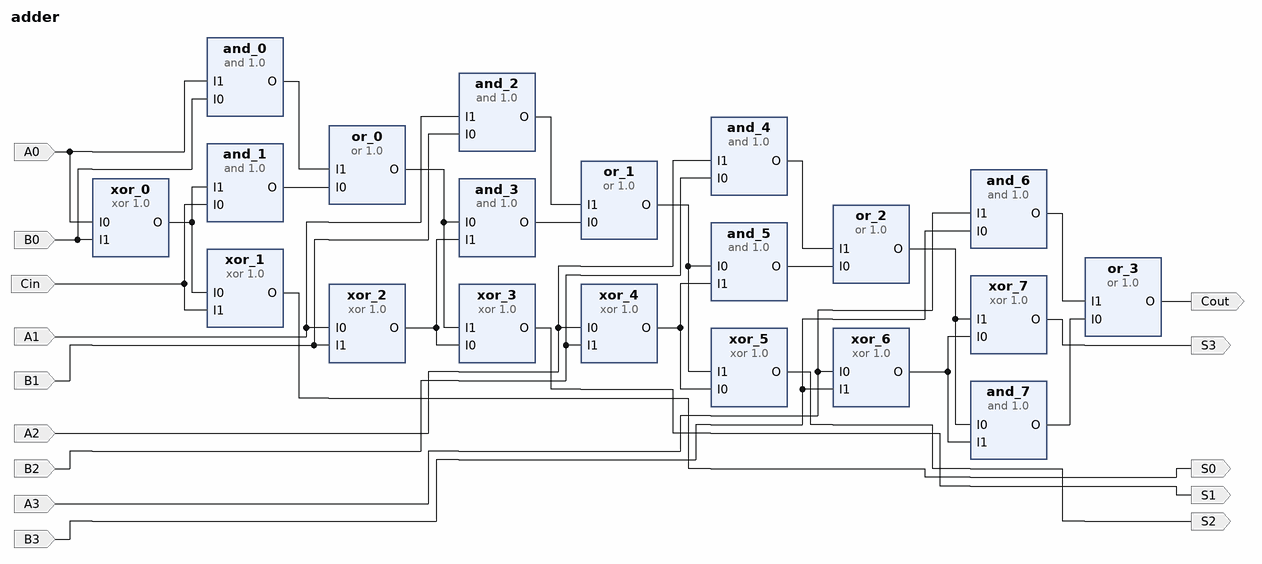
[diagram p0: block diagram of the top level]
# Vivado block design adder, xc7a35tcpg236-1, Vivado 2018.2
create_bd_design adder

create_bd_port -dir I A0
create_bd_port -dir I B0
create_bd_port -dir I Cin
create_bd_port -dir O S0
create_bd_port -dir I A1
create_bd_port -dir I B1
create_bd_port -dir O S1
create_bd_port -dir I A2
create_bd_port -dir I B2
create_bd_port -dir O S2
create_bd_port -dir I A3
create_bd_port -dir I B3
create_bd_port -dir O S3
create_bd_port -dir O Cout

create_bd_cell -type ip -vlnv FIT:user:and:1.0 and_0
create_bd_cell -type ip -vlnv FIT:user:and:1.0 and_1
create_bd_cell -type ip -vlnv FIT:user:or:1.0 or_0
create_bd_cell -type ip -vlnv FIT:user:xor:1.0 xor_0
create_bd_cell -type ip -vlnv FIT:user:xor:1.0 xor_1
create_bd_cell -type ip -vlnv FIT:user:and:1.0 and_2
create_bd_cell -type ip -vlnv FIT:user:and:1.0 and_3
create_bd_cell -type ip -vlnv FIT:user:or:1.0 or_1
create_bd_cell -type ip -vlnv FIT:user:xor:1.0 xor_2
create_bd_cell -type ip -vlnv FIT:user:xor:1.0 xor_3
create_bd_cell -type ip -vlnv FIT:user:and:1.0 and_4
create_bd_cell -type ip -vlnv FIT:user:and:1.0 and_5
create_bd_cell -type ip -vlnv FIT:user:or:1.0 or_2
create_bd_cell -type ip -vlnv FIT:user:xor:1.0 xor_4
create_bd_cell -type ip -vlnv FIT:user:xor:1.0 xor_5
create_bd_cell -type ip -vlnv FIT:user:and:1.0 and_6
create_bd_cell -type ip -vlnv FIT:user:and:1.0 and_7
create_bd_cell -type ip -vlnv FIT:user:or:1.0 or_3
create_bd_cell -type ip -vlnv FIT:user:xor:1.0 xor_6
create_bd_cell -type ip -vlnv FIT:user:xor:1.0 xor_7

# ---- connections ----

connect_bd_net [get_bd_pins and_0/O] [get_bd_pins or_0/I1]
connect_bd_net [get_bd_pins and_1/O] [get_bd_pins or_0/I0]
connect_bd_net -net A0_1 [get_bd_ports A0] [get_bd_pins and_0/I1] [get_bd_pins xor_0/I0]
connect_bd_net -net B0_1 [get_bd_ports B0] [get_bd_pins and_0/I0] [get_bd_pins xor_0/I1]
connect_bd_net [get_bd_ports Cin] [get_bd_pins xor_1/I1] [get_bd_pins and_1/I0]
connect_bd_net [get_bd_pins xor_0/O] [get_bd_pins xor_1/I0] [get_bd_pins and_1/I1]
connect_bd_net [get_bd_pins xor_1/O] [get_bd_ports S0]
connect_bd_net -net A0_2 [get_bd_ports A1] [get_bd_pins and_2/I1] [get_bd_pins xor_2/I0]
connect_bd_net -net B0_2 [get_bd_ports B1] [get_bd_pins and_2/I0] [get_bd_pins xor_2/I1]
connect_bd_net -net Cin_2 [get_bd_pins or_0/O] [get_bd_pins xor_3/I1] [get_bd_pins and_3/I0]
connect_bd_net -net and_0_O1 [get_bd_pins and_2/O] [get_bd_pins or_1/I1]
connect_bd_net -net and_1_O1 [get_bd_pins and_3/O] [get_bd_pins or_1/I0]
connect_bd_net -net xor_0_O1 [get_bd_pins xor_2/O] [get_bd_pins xor_3/I0] [get_bd_pins and_3/I1]
connect_bd_net -net xor_1_O1 [get_bd_pins xor_3/O] [get_bd_ports S1]
connect_bd_net -net A0_3 [get_bd_ports A2] [get_bd_pins and_4/I1] [get_bd_pins xor_4/I0]
connect_bd_net -net B0_3 [get_bd_ports B2] [get_bd_pins and_4/I0] [get_bd_pins xor_4/I1]
connect_bd_net -net Cin_3 [get_bd_pins or_1/O] [get_bd_pins xor_5/I1] [get_bd_pins and_5/I0]
connect_bd_net -net and_0_O2 [get_bd_pins and_4/O] [get_bd_pins or_2/I1]
connect_bd_net -net and_1_O2 [get_bd_pins and_5/O] [get_bd_pins or_2/I0]
connect_bd_net -net xor_0_O2 [get_bd_pins xor_4/O] [get_bd_pins xor_5/I0] [get_bd_pins and_5/I1]
connect_bd_net -net xor_1_O2 [get_bd_pins xor_5/O] [get_bd_ports S2]
connect_bd_net -net A0_4 [get_bd_ports A3] [get_bd_pins and_6/I1] [get_bd_pins xor_6/I0]
connect_bd_net -net B0_4 [get_bd_ports B3] [get_bd_pins and_6/I0] [get_bd_pins xor_6/I1]
connect_bd_net -net Cin_4 [get_bd_pins or_2/O] [get_bd_pins xor_7/I1] [get_bd_pins and_7/I0]
connect_bd_net -net and_0_O3 [get_bd_pins and_6/O] [get_bd_pins or_3/I1]
connect_bd_net -net and_1_O3 [get_bd_pins and_7/O] [get_bd_pins or_3/I0]
connect_bd_net -net xor_0_O3 [get_bd_pins xor_6/O] [get_bd_pins xor_7/I0] [get_bd_pins and_7/I1]
connect_bd_net -net xor_1_O3 [get_bd_pins xor_7/O] [get_bd_ports S3]
connect_bd_net -net or_0_O3 [get_bd_pins or_3/O] [get_bd_ports Cout]

validate_bd_design
save_bd_design
